# Altium schematic sheet SpW_protection.SchDoc: SpaceWire protection
size A4; Organization: Creotech Instruments; Address1: Gen. L. Okulickiego 7/9; Address2: 05-500 Piaseczno; Address3: Poland
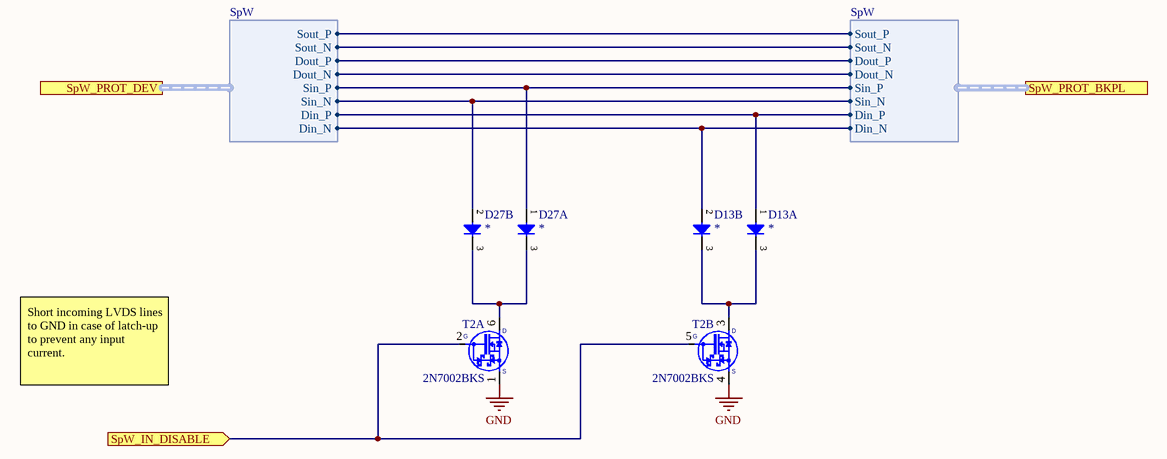
[diagram p0: SpW_protection.SchDoc]

## Parts
D13  *  [SOT65P210X110-3N]  (parts A,B of 2)
D27  *  [SOT65P210X110-3N]  (parts A,B of 2)
T2  2N7002BKS  [SOT65P210X110-6N]  (parts A,B of 2)

## Ports
SpW_IN_DISABLE (in), SpW_PROT_BKPL (harness SpW), SpW_PROT_DEV (harness SpW)

## Harnesses
SpW: Sout_P, Sout_N, Dout_P, Dout_N, Sin_P, Sin_N, Din_P, Din_N

## Nets
GND: T2.1(S) T2.4(S)
SpW_IN_DISABLE: T2.2(G) T2.5(G) ; port SpW_IN_DISABLE
NetD13_1: D13.1(A) ; port SpW_PROT_BKPL.Din_P, port SpW_PROT_DEV.Din_P
NetD13_2: D13.2(A) ; port SpW_PROT_BKPL.Din_N, port SpW_PROT_DEV.Din_N
NetD13_3: D13.3(COMC) T2.3(D)
NetD27_1: D27.1(A) ; port SpW_PROT_BKPL.Sin_P, port SpW_PROT_DEV.Sin_P
NetD27_2: D27.2(A) ; port SpW_PROT_BKPL.Sin_N, port SpW_PROT_DEV.Sin_N
NetD27_3: D27.3(COMC) T2.6(D)
(unnamed): port SpW_PROT_BKPL.Sout_P, port SpW_PROT_DEV.Sout_P
(unnamed): port SpW_PROT_BKPL.Sout_N, port SpW_PROT_DEV.Sout_N
(unnamed): port SpW_PROT_BKPL.Dout_P, port SpW_PROT_DEV.Dout_P
(unnamed): port SpW_PROT_BKPL.Dout_N, port SpW_PROT_DEV.Dout_N

## Notes on the sheet
- Short incoming LVDS lines to GND in case of latch-up to prevent any input current.
- Title
- Size:
- Date:
- A4
- Number:
- Time:
- Revision:
- Sheet
- of
- File:

## Library data of the parts
D13 D27 = BAT1705WH: Manufacturer Part Number: BAT1705WH6327; Bonding: No; PressFit: No; Case: *; Component Kind: Standard; Component Type: Standard; ComponentHeigth: *; CreateDate: 2018-01-01; Device: *; Footprint: *; HelpURL: *; LatestRevisionDate: 2018-01-01; Manufacturer: *; Mounted: Yes; PackageDescription: *; Part Description: *; Part Number: BAT1705WH6327; Pin Count: *; Sense: No; SMD: Yes; Socket: No; Value: *
T2 = 2N7002BKS: 60V, 300mA Dual N-Channel Trench MOSFET; Manufacturer: NXP SEMICONDUCTORS; Manufacturer Part Number: 2N7002BKS6; PressFit: No; Bonding: No; Part Number: 2N7002BKS; Component Kind: Standard; Component Type: Standard; Device: 2N7002BKS; PackageDescription: SOT363, SC70-6, SOT, 0.65mm Pitch, 6 pin, 1.25mm W X 2.00mm L X 1.10mm H, IPC Medium Density; Part Description: 60 V, 300 mA Dual N-Channel Trench MOSFET; Pin Count: 4; Case: SOT363; Mounted: Yes; Socket: No; SMD: Yes; Sense: No; ComponentHeight: 1.1mm; HelpURL: \\cern.ch\dfs\Applications\Altium\Datasheets\2N7002BKS.pdf; Author: CERN DEM JLC; CreateDate: 2012-11-27; LatestRevisionDate: 2012-11-27